# Altium project Sima_board.PrjPcb
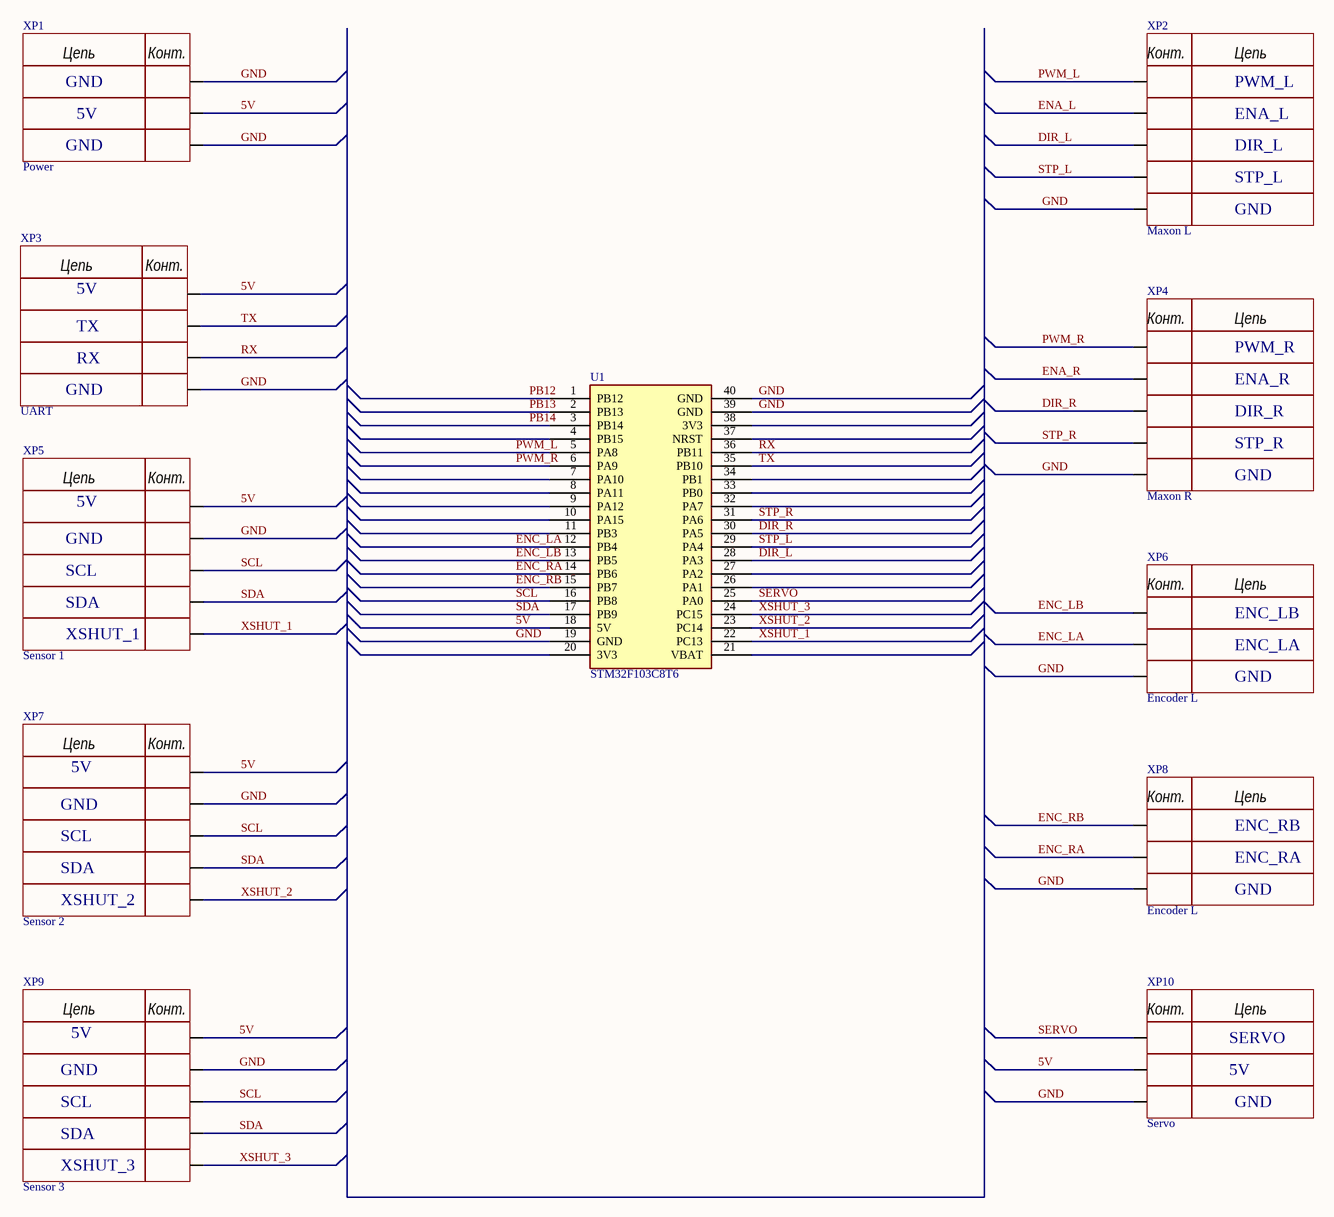
[diagram p0: Sheet1.SchDoc]
1 sheet, 11 parts. Net scope: global (net labels, ports and power ports of the same name join across sheets).
Board file: PCB1.PcbDoc

## Sheet Sheet1.SchDoc
size A3; DrawnBy: Babakyan Ruslan

### Parts
U1  STM32F103C8T6  [Stm32 BluePill]
XP1  Power  [B3B-PH-K-S]
XP2  Maxon L  [B5B-PH-K-S]
XP3  UART  [B4B-PH-K-S]
XP4  Maxon R  [B5B-PH-K-S]
XP5  Sensor 1  [B5B-PH-K-S]
XP6  Encoder L  [B3B-PH-K-S]
XP7  Sensor 2  [B5B-PH-K-S]
XP8  Encoder L  [B3B-PH-K-S]
XP9  Sensor 3  [B5B-PH-K-S]
XP10  Servo  [B3B-PH-K-S]

### Nets
5V: U1.18(5V) XP1.2 XP3.1 XP5.1 XP7.1 XP9.1 XP10.2
DIR_L: U1.28(PA3) XP2.3
DIR_R: U1.30(PA5) XP4.3
ENA_L: XP2.2
ENA_R: XP4.2
ENC_LA: U1.12(PB4) XP6.2
ENC_LB: U1.13(PB5) XP6.1
ENC_RA: U1.14(PB6) XP8.2
ENC_RB: U1.15(PB7) XP8.1
GND: U1.19(GND) U1.39(GND) U1.40(GND) XP1.1 XP1.3 XP2.5 XP3.4 XP4.5 XP5.2 XP6.3 XP7.2 XP8.3 XP9.2 XP10.3
PB12: U1.1(PB12)
PB13: U1.2(PB13)
PB14: U1.3(PB14)
PWM_L: U1.5(PA8) XP2.1
PWM_R: U1.6(PA9) XP4.1
RX: U1.36(PB11) XP3.3
SCL: U1.16(PB8) XP5.3 XP7.3 XP9.3
SDA: U1.17(PB9) XP5.4 XP7.4 XP9.4
SERVO: U1.25(PA0) XP10.1
STP_L: U1.29(PA4) XP2.4
STP_R: U1.31(PA6) XP4.4
TX: U1.35(PB10) XP3.2
XSHUT_1: U1.22(PC13) XP5.5
XSHUT_2: U1.23(PC14) XP7.5
XSHUT_3: U1.24(PC15) XP9.5

Not connected (* = marked no-connect by the designer): U1 4(PB15) 7(PA10) 8(PA11) 9(PA12) 10(PA15) 11(PB3) 20(3V3) 21(VBAT) 26(PA1) 27(PA2) 32(PA7) 33(PB0) 34(PB1) 37(NRST) 38(3V3)

### Notes on the sheet
- GND
- PWM_L
- 5V
- DIR_L
- ENA_L
- STP_L
- TX
- RX
- PWM_R
- DIR_R
- ENA_R
- STP_R
- SCL
- SDA
- XSHUT_1
- ENC_LB
- ENC_LA
- ENC_RB
- XSHUT_2
- ENC_RA
- SERVO
- XSHUT_3
- (in symbol B3B-PH-K-S) Цепь; Конт.
- (in symbol B4B-PH-K-S) Конт.; Цепь
- (in symbol B5B-PH-K-S) Цепь; Конт.

### Library data of the parts
U1 = BluePill: Designed By @Alixahedi
XP1 XP6 XP8 XP10 = B3B-PH-K-S: Manufacturer: JST Corporation; Name: B4B-PH-K-S; PHR-4; SPH-002T-P0.5*; Group: Соединение контактное типа штырь; Datasheet: https://static.chipdip.ru/lib/667/DOC012667266.pdf
XP2 XP4 XP5 XP7 XP9 = B5B-PH-K-S
XP3 = B4B-PH-K-S: Manufacturer: JST Corporation; Name: B4B-PH-K-S; PHR-4; SPH-002T-P0.5*; Group: Соединение контактное типа штырь; Datasheet: https://static.chipdip.ru/lib/667/DOC012667266.pdf